# EasyEDA Pro project ProPrj_BSPD_2025-08-26.epro, schematic Schematic2
Board Name: LING; Create Date: 2025-08-26; Page Name: P1; Project Name: BSPD; Schematic Name: Schematic2; Update Date: 2025-08-26; Company: 嘉立创EDA; Page Size: A4; Version: V1.0
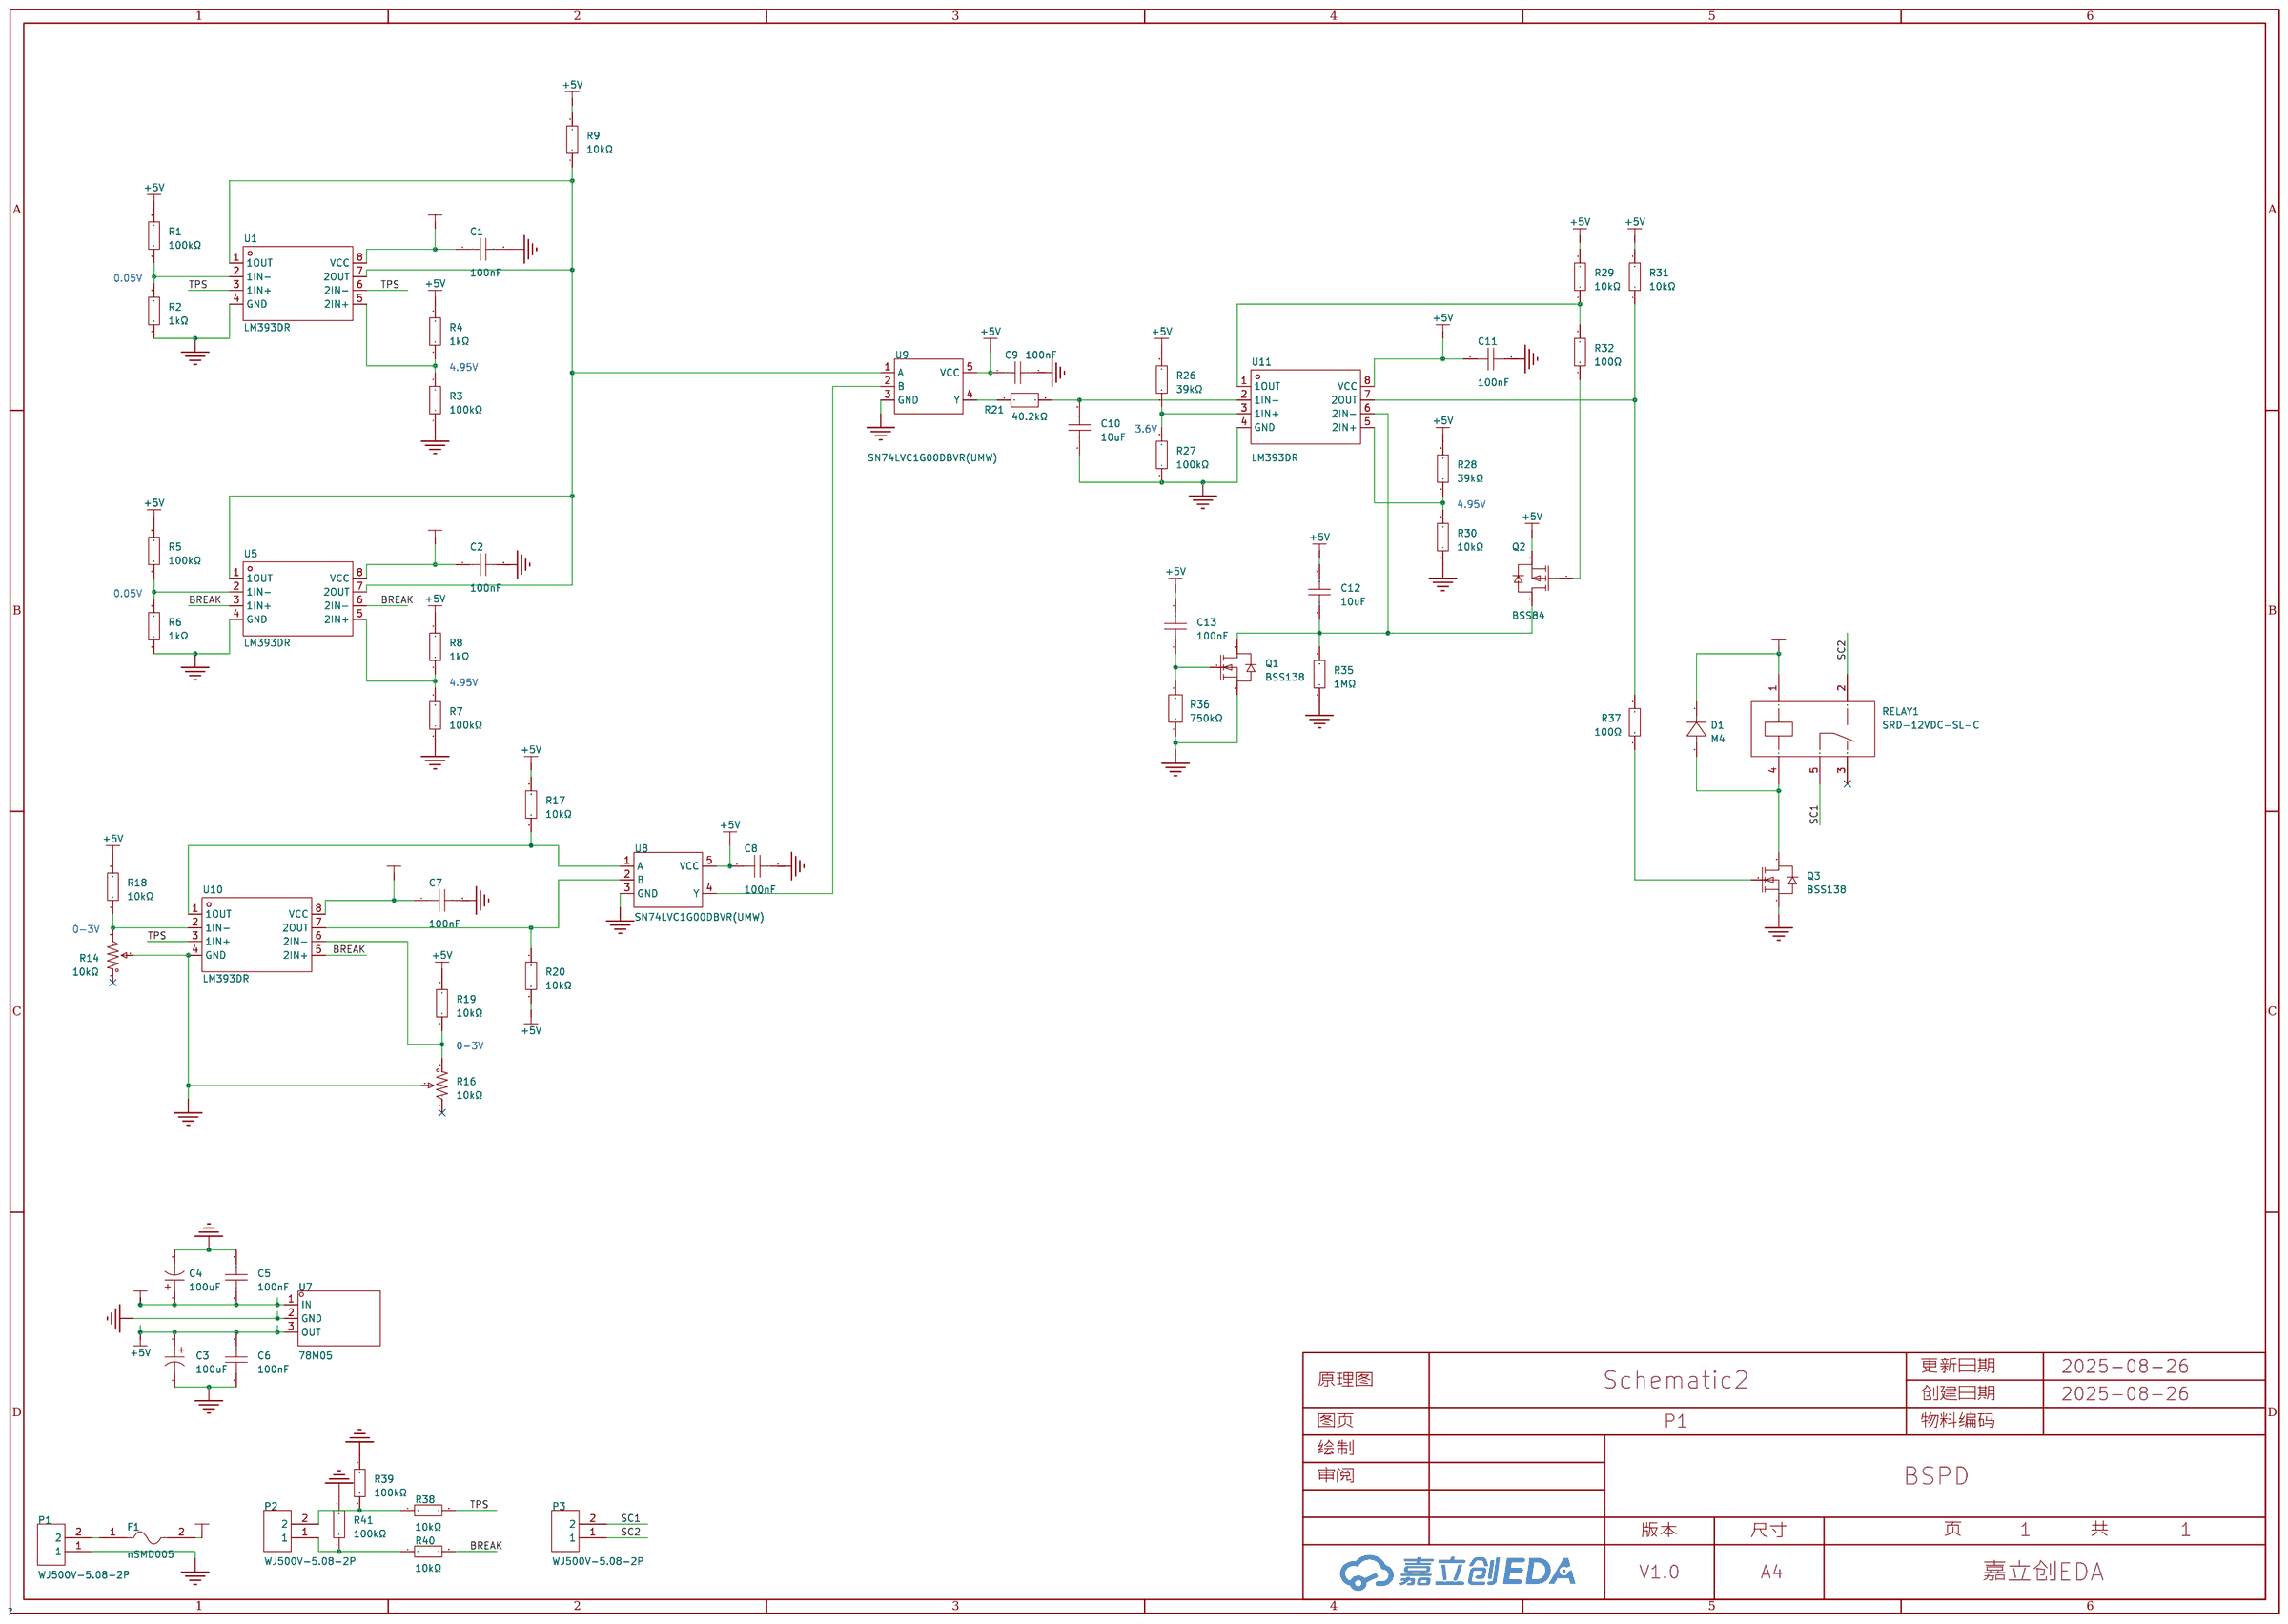
[diagram p1: schematic sheet]

## Parts
C1  100nF  [C0603]
C2  100nF  [C0603]
C3  100uF  [CAP-SMD_BD6.3-L6.6-W6.6-LS7.4-FD]
C4  100uF  [CAP-SMD_BD6.3-L6.6-W6.6-LS7.4-FD]
C5  100nF  [C0603]
C6  100nF  [C0603]
C7  100nF  [C0603]
C8  100nF  [C0603]
C9  100nF  [C0603]
C10  10uF  [C0603]
C11  100nF  [C0603]
C12  10uF  [C0603]
C13  100nF  [C0603]
D1  M4  [SMA_L4.3-W2.6-LS5.0-RD]
F1  nSMD005  [F1206]
P1  WJ500V-5.08-2P  [CONN-TH_2P-P5.00_WJ500V-5.08-2P]
P2  WJ500V-5.08-2P  [CONN-TH_2P-P5.00_WJ500V-5.08-2P]
P3  WJ500V-5.08-2P  [CONN-TH_2P-P5.00_WJ500V-5.08-2P]
Q1  BSS138  [SOT-23-3_L2.9-W1.3-P1.90-LS2.4-BR]
Q2  BSS84  [SOT-23-3_L2.9-W1.3-P1.90-LS2.4-BR-1]
Q3  BSS138  [SOT-23-3_L2.9-W1.3-P1.90-LS2.4-BR]
R1  100kΩ  [R0603]
R2  1kΩ  [R0603]
R3  100kΩ  [R0603]
R4  1kΩ  [R0603]
R5  100kΩ  [R0603]
R6  1kΩ  [R0603]
R7  100kΩ  [R0603]
R8  1kΩ  [R0603]
R9  10kΩ  [R0603]
R14  10kΩ  [RES-ADJ-TH_3P-L10.0-W10.0-P2.50-L]
R16  10kΩ  [RES-ADJ-TH_3P-L10.0-W10.0-P2.50-L]
R17  10kΩ  [R0603]
R18  10kΩ  [R0603]
R19  10kΩ  [R0603]
R20  10kΩ  [R0603]
R21  40.2kΩ  [R0603]
R26  39kΩ  [R0603]
R27  100kΩ  [R0603]
R28  39kΩ  [R0603]
R29  10kΩ  [R0603]
R30  10kΩ  [R0603]
R31  10kΩ  [R0603]
R32  100Ω  [R0603]
R35  1MΩ  [R0603]
R36  750kΩ  [R0603]
R37  100Ω  [R0603]
R38  10kΩ  [R0603]
R39  100kΩ  [R0603]
R40  10kΩ  [R0603]
R41  100kΩ  [R0603]
RELAY1  SRD-12VDC-SL-C  [RELAY-TH_SRD-XXVDC-XL-C]
U1  LM393DR  [SOIC-8_L5.0-W4.0-P1.27-LS6.0-BL]
U5  LM393DR  [SOIC-8_L5.0-W4.0-P1.27-LS6.0-BL]
U7  78M05  [TO-252-2_L6.6-W6.1-P4.57-LS9.9-BR-CW]
U8  SN74LVC1G00DBVR(UMW)  [SOT-23-5_L2.9-W1.6-P0.95-LS2.8-BL]
U9  SN74LVC1G00DBVR(UMW)  [SOT-23-5_L2.9-W1.6-P0.95-LS2.8-BL]
U10  LM393DR  [SOIC-8_L5.0-W4.0-P1.27-LS6.0-BL]
U11  LM393DR  [SOIC-8_L5.0-W4.0-P1.27-LS6.0-BL]

## Library data of the parts
C1 C2 C5-C9 C11 C13 = CGA0603X7R104K500JT: 容值:100nF;精度:±10%;额定电压:50V;温度系数:X7R;; LCSC Part Name: 100nF ±10% 50V; Supplier Part: C6119867; Manufacturer: HRE(芯声); Supplier Footprint: 0603; JLCPCB Part Class: 扩展库; Datasheet: https://atta.szlcsc.com/upload/public/pdf/source/20250103/C44077DA9E7B3EFAE02F22B6D3D1CBC9.pdf; Supplier: LCSC; Tolerance: ±10%; Voltage Rating: 50V; Temperature Coefficient: X7R
C3 C4 = RVT100UF35V67RV0034: 容值:100uF;精度:±20%;额定电压:35V;纹波电流:87mA@120kHz;等效串联电阻:-;; LCSC Part Name: 100uF ±20% 35V; Supplier Part: C2836442; Manufacturer: KNSCHA(科尼盛); Supplier Footprint: SMD,D6.3xL7.7mm; JLCPCB Part Class: 扩展库; Datasheet: https://atta.szlcsc.com/upload/public/pdf/source/20210528/C2836442_7F6389BF36F63F32D6DF3A507E8E95D6.pdf; Supplier: LCSC; Tolerance: ±20%; Rated Voltage: 35V; Ripple Current: 87mA@120kHz; φD: 6.3mm; L: 7.7mm; Lifetime @ Temp: 2000hrs@105℃; Operating Temperature: -55℃~+105℃
C10 C12 = CGA0603X5R106K100JT: 容值:10uF;精度:±10%;额定电压:10V;温度系数:X5R;; LCSC Part Name: 10uF ±10% 10V; Supplier Part: C6119842; Manufacturer: HRE(芯声); Supplier Footprint: 0603; JLCPCB Part Class: 扩展库; Supplier: LCSC; Tolerance: ±10%; Voltage Rating: 10V; Temperature Coefficient: X5R
D1 = M4_C18199095: 二极管配置:独立式;正向压降(Vf):1V@1A;直流反向耐压(Vr):400V;整流电流:1A;; Supplier Part: C18199095; Manufacturer: 宏迦橙; Supplier Footprint: SMA(DO-214AC); JLCPCB Part Class: 扩展库; Datasheet: https://atta.szlcsc.com/upload/public/pdf/source/20231013/89B063F116204BE8B8ABA73B73AC0E7A.pdf; Supplier: LCSC; Diode Configuration: 独立式; Forward Voltage (Vf@If): 1V@1A; Reverse Voltage (Vr): 400V; Rectified Current: 1A; Reverse Leakage Current (Ir): 2uA@400V
F1 = nSMD005: 耐压:60V;最大电流:100A;保持电流(Ih):50mA;跳闸电流:150mA;; LCSC Part Name: 60V 50mA 1206自恢复; Supplier Part: C70064; Manufacturer: 台湾陆海; Supplier Footprint: 1206; JLCPCB Part Class: 扩展库; Datasheet: https://atta.szlcsc.com/upload/public/pdf/source/20160331/1459396376533.pdf; Supplier: LCSC; Voltage - Max: 60V; Current - Max: 100A; Hold Current: 50mA; Trip Current: 150mA
P1-P3 = WJ500V-5.08-2P: 结构:1x2P;间距:5.08mm;颜色:绿色;安装方式:直插;额定电流:18A;额定电压:250V;排数:1;线规 - AWG:14~30;线规 - 平方毫米:2.5;每排PIN数:2;触头材质:-;触头镀层:-;工作温度范围:-40℃~+105℃;焊接温度(最大值):-;; LCSC Part Name: 1x2P 5.08mm 直插 排数:1 每排P数:2; Supplier Part: C8465; Manufacturer: KANGNEX(康奈克斯电气); Supplier Footprint: 插件,P=5.08mm; JLCPCB Part Class: 扩展库; Datasheet: https://atta.szlcsc.com/upload/public/pdf/source/20191225/C8465_02D34CE5B5B4A53DF5891601D97FA9F4.pdf; Supplier: LCSC; Structure: 1x2P; Pitch: 5.08mm; Color: 绿色; Mounting Style: 直插; Current Rating (Max): 18A; Voltage Rating (Max): 250V; Number of Pins: 2P; Number of Rows: 1; Wire Gauge - AWG: 14~30; Wire Gauge - mm2: 2.5; Number of PINs Per Row: 2; Operating Temperature Range: -40℃~+105℃; Screw Specification: M2.5
Q1 Q3 = BSS138_C7420339: 类型:1个N沟道;漏源电压(Vdss):50V;连续漏极电流(Id):340mA;导通电阻(RDS(on)):2.5Ω@10V,340mA;耗散功率(Pd):350mW;阈值电压(Vgs(th)):1.6V;; LCSC Part Name: N沟道,电流:340mA,耐压:50V; Supplier Part: C7420339; Manufacturer: 宏嘉诚; Supplier Footprint: SOT-23; JLCPCB Part Class: 扩展库; Datasheet: https://atta.szlcsc.com/upload/public/pdf/source/20250106/6679E24F3D42D0BF4A4F6E14986335A4.pdf; Supplier: LCSC; Type: 1个N沟道; Drain to Source Voltage: 50V; Current - Continuous Drain(Id): 340mA; RDS(on): 2.5Ω@10V,340mA; Pd - Power Dissipation: 350mW; Gate Threshold Voltage (Vgs(th)@Id): 1.6V; Gate Charge(Qg): 1.7nC@10V; Input Capacitance(Ciss@Vds): 17.5pF@25V; Reverse Transfer Capacitance (Crss@Vds): 6.5pF@25V; Operating Temperature: -55℃~+150℃
Q2 = BSS84_C7420340: 类型:1个P沟道;漏源电压(Vdss):60V;连续漏极电流(Id):170mA;导通电阻(RDS(on)):8Ω@10V,0.17A;耗散功率(Pd):225mW;阈值电压(Vgs(th)):900mV;; LCSC Part Name: P沟道,电流:-0.17A,耐压:-60V; Supplier Part: C7420340; Manufacturer: 宏嘉诚; Supplier Footprint: SOT-23; JLCPCB Part Class: 扩展库; Datasheet: https://atta.szlcsc.com/upload/public/pdf/source/20250106/7DBB75318F8E5F43EACD3BE75B7C3ED0.pdf; Supplier: LCSC; Type: 1个P沟道; Drain to Source Voltage: 60V; Current - Continuous Drain(Id): 170mA; RDS(on): 8Ω@10V,0.17A; Pd - Power Dissipation: 225mW; Gate Threshold Voltage (Vgs(th)@Id): 900mV; Gate Charge(Qg): 1.77nC@10V; Input Capacitance(Ciss@Vds): 43pF; Reverse Transfer Capacitance (Crss@Vds): 2.8pF; Operating Temperature: -55℃~+150℃
R1 R3 R5 R7 R27 R39 R41 = 0603WAF1003T5E: 电阻类型:厚膜电阻;阻值:100kΩ;精度:±1%;功率:100mW;最大工作电压:75V;温度系数:±100ppm/℃;; LCSC Part Name: 100kΩ ±1% 100mW 厚膜电阻; Supplier Part: C25803; Manufacturer: UNI-ROYAL(厚声); Supplier Footprint: 0603; JLCPCB Part Class: 基础库; Datasheet: https://atta.szlcsc.com/upload/public/pdf/source/20200306/C422600_1E6D84923E4A46A82E41ADD87F860B5C.pdf; Supplier: LCSC; Type: 厚膜电阻; Tolerance: ±1%; Power(Watts): 100mW; Overload Voltage (Max): 75V; Temperature Coefficient: ±100ppm/℃; Operating Temperature Range: -55℃~+155℃
R2 R4 R6 R8 = 0603WAF1001T5E: 电阻类型:厚膜电阻;阻值:1kΩ;精度:±1%;功率:100mW;最大工作电压:75V;温度系数:±100ppm/℃;; LCSC Part Name: 1kΩ ±1% 100mW 厚膜电阻; Supplier Part: C21190; Manufacturer: UNI-ROYAL(厚声); Supplier Footprint: 0603; JLCPCB Part Class: 基础库; Datasheet: https://atta.szlcsc.com/upload/public/pdf/source/20200306/C422600_1E6D84923E4A46A82E41ADD87F860B5C.pdf; Supplier: LCSC; Type: 厚膜电阻; Tolerance: ±1%; Power(Watts): 100mW; Overload Voltage (Max): 75V; Temperature Coefficient: ±100ppm/℃; Operating Temperature Range: -55℃~+155℃
R9 R17-R20 R29-R31 R38 R40 = 0603WAF1002T5E: 电阻类型:厚膜电阻;阻值:10kΩ;精度:±1%;功率:100mW;最大工作电压:75V;温度系数:±100ppm/℃;; LCSC Part Name: 厚膜电阻 10kΩ ±1% 100mW; Supplier Part: C25804; Manufacturer: UNI-ROYAL(厚声); Supplier Footprint: 0603; JLCPCB Part Class: 基础库; Datasheet: https://atta.szlcsc.com/upload/public/pdf/source/20200306/C422600_1E6D84923E4A46A82E41ADD87F860B5C.pdf; Supplier: LCSC; Type: 厚膜电阻; Tolerance: ±1%; Power(Watts): 100mW; Overload Voltage (Max): 75V; Temperature Coefficient: ±100ppm/℃; Operating Temperature Range: -55℃~+155℃
R14 R16 = 3296W-1-103: 阻值:10kΩ;精度:±10%;; LCSC Part Name: 10kΩ ±10%; Supplier Part: C118954; Manufacturer: BOCHEN(博晨); Supplier Footprint: 插件; JLCPCB Part Class: 扩展库; Datasheet: https://atta.szlcsc.com/upload/public/pdf/source/20171114/C118954_15106326646611117443.pdf; Supplier: LCSC; Tolerance: ±10%
R21 = FRC0603F4022TS: 电阻类型:厚膜电阻;阻值:40.2kΩ;精度:±1%;功率:100mW;最大工作电压:75V;温度系数:±100ppm/℃;; LCSC Part Name: 40.2kΩ ±1% 100mW 厚膜电阻; Supplier Part: C2933218; Manufacturer: FOJAN(富捷); Supplier Footprint: 0603; JLCPCB Part Class: 扩展库; Datasheet: https://atta.szlcsc.com/upload/public/pdf/source/20211221/925EC7D7225764EE0046F22065062C87.pdf; Supplier: LCSC; Type: 厚膜电阻; Tolerance: ±1%; Power(Watts): 100mW; Overload Voltage (Max): 75V; Temperature Coefficient: ±100ppm/℃; Operating Temperature Range: -55℃~+155℃
R26 R28 = 0603WAF3902T5E: 电阻类型:厚膜电阻;阻值:39kΩ;精度:±1%;功率:100mW;最大工作电压:75V;温度系数:±100ppm/℃;; LCSC Part Name: 39kΩ ±1% 100mW 厚膜电阻; Supplier Part: C23153; Manufacturer: UNI-ROYAL(厚声); Supplier Footprint: 0603; JLCPCB Part Class: 基础库; Datasheet: https://atta.szlcsc.com/upload/public/pdf/source/20200306/C422600_1E6D84923E4A46A82E41ADD87F860B5C.pdf; Supplier: LCSC; Type: 厚膜电阻; Tolerance: ±1%; Power(Watts): 100mW; Overload Voltage (Max): 75V; Temperature Coefficient: ±100ppm/℃; Operating Temperature Range: -55℃~+155℃
R32 R37 = 0603WAF1000T5E: 电阻类型:厚膜电阻;阻值:100Ω;精度:±1%;功率:100mW;最大工作电压:75V;温度系数:±200ppm/℃;; LCSC Part Name: 100Ω ±1% 100mW 厚膜电阻; Supplier Part: C22775; Manufacturer: UNI-ROYAL(厚声); Supplier Footprint: 0603; JLCPCB Part Class: 基础库; Datasheet: https://atta.szlcsc.com/upload/public/pdf/source/20200306/C422600_1E6D84923E4A46A82E41ADD87F860B5C.pdf; Supplier: LCSC; Type: 厚膜电阻; Tolerance: ±1%; Power(Watts): 100mW; Overload Voltage (Max): 75V; Temperature Coefficient: ±200ppm/℃; Operating Temperature Range: -55℃~+155℃
R35 = 0603WAF1004T5E: 电阻类型:厚膜电阻;阻值:1MΩ;精度:±1%;功率:100mW;最大工作电压:75V;温度系数:±100ppm/℃;; LCSC Part Name: 1MΩ ±1% 100mW 厚膜电阻; Supplier Part: C22935; Manufacturer: UNI-ROYAL(厚声); Supplier Footprint: 0603; JLCPCB Part Class: 基础库; Datasheet: https://atta.szlcsc.com/upload/public/pdf/source/20200306/C422600_1E6D84923E4A46A82E41ADD87F860B5C.pdf; Supplier: LCSC; Type: 厚膜电阻; Tolerance: ±1%; Power(Watts): 100mW; Overload Voltage (Max): 75V; Temperature Coefficient: ±100ppm/℃; Operating Temperature Range: -55℃~+155℃
R36 = FRC0603J754 TS: 电阻类型:厚膜电阻;阻值:750kΩ;精度:±5%;功率:100mW;最大工作电压:75V;温度系数:±100ppm/℃;; LCSC Part Name: 750kΩ ±5% 100mW 厚膜电阻; Supplier Part: C2907201; Manufacturer: FOJAN(富捷); Supplier Footprint: 0603; JLCPCB Part Class: 扩展库; Datasheet: https://atta.szlcsc.com/upload/public/pdf/source/20211221/925EC7D7225764EE0046F22065062C87.pdf; Supplier: LCSC; Type: 厚膜电阻; Tolerance: ±5%; Power(Watts): 100mW; Overload Voltage (Max): 75V; Temperature Coefficient: ±100ppm/℃; Operating Temperature Range: -55℃~+155℃
RELAY1 = SRD-12VDC-SL-C: 线圈电压:12V;触点形式:一组转换:1C(单刀双掷-转换);触点容量(电阻负载):-;最大切换电压:250V@AC;最大切换电流:15A;; Supplier Part: C30431; Manufacturer: 松乐; Supplier Footprint: 插件,15.6x19.2mm; JLCPCB Part Class: 扩展库; Datasheet: https://atta.szlcsc.com/upload/public/pdf/source/20200305/C490149_C96E4098A3B1FFB377D5AD2E40B7C2A8.pdf; Supplier: LCSC; Coil Voltage: 12V; Contact Form: 一组转换:1C(单刀双掷-转换); Pin Number: 5; Maximum Switching Voltage: 250V@AC; Coil Rated Power: 360mW; Maximum Switching Current: 15A; Coil Type: 无极性-单线圈; Coil Resistance: 400Ω; Contact Resistance: 100mΩ; Operate Time: 10ms; Release Time: 10ms
U1 U5 U10 U11 = LM393DR: 输入失调电压(Vos):5mV;输入偏置电流(Ib):250nA;; Supplier Part: C67470; Manufacturer: TI(德州仪器); Supplier Footprint: SOIC-8; JLCPCB Part Class: 扩展库; Datasheet: https://www.ti.com/cn/lit/gpn/lm393; Supplier: LCSC; Input Offset Voltage (Vos): 5mV; Input Bias Current (Ib): 250nA; Supply Voltage: 1V~18V；2V~36V; Output Type: 开集; Supply Current: 2.5mA; Operating Temperature: 0℃~+70℃
U7 = 78M05_C347278: 输出类型:固定;最大输入电压:35V;输出电压:5V;输出电流:1A;电源纹波抑制比(PSRR):80dB@(120Hz);输出极性:正极;; LCSC Part Name: 输入35V 输出5V; Supplier Part: C347278; Manufacturer: UMW(友台半导体); Supplier Footprint: TO-252-2; JLCPCB Part Class: 扩展库; Datasheet: https://atta.szlcsc.com/upload/public/pdf/source/20240827/0E07D62EB5B1694607256ADF81712489.pdf; Supplier: LCSC; Output Type: 固定; Maximum Input Voltage: 35V; Output Voltage: 5V; Output Current: 1A; Power Supply Rejection Ratio (PSRR): 80dB@(120Hz); Dropout Voltage: 2V@(500mA); standby current: 6mA; Feature: 短路保护；热保护(TSD); Operating Temperature: -20℃~+85℃; Output Polarity: 正极; Number of Outputs: 1
U8 U9 = SN74LVC1G00DBVR(UMW): 逻辑类型:与非门;通道数:1;工作电压:1.65V~5.5V;静态电流(Iq):10uA;传播延迟(tpd):10ns@5V,15pF;; LCSC Part Name: 门极和反相器; Supplier Part: C434066; Manufacturer: UMW(友台半导体); Supplier Footprint: SOT-23-5; JLCPCB Part Class: 扩展库; Datasheet: https://atta.szlcsc.com/upload/public/pdf/source/20240514/189D9F5C308E2EFD5DBBE0C24B0B7D67.pdf; Supplier: LCSC; Logic Gate Type: 与非门; Number of Channels: 1; Supply Voltage: 1.65V~5.5V; Quiescent Current (Max): 10uA; Sink Current: 32mA; Source Current: 32mA; High Level Range (VIH): 1.7V; Series: 74LVC系列; Propagation Delay Time: 10ns@5V,15pF; Operating Temperature: -40℃~+105℃

## Nets
12V: C1.1 C2.1 C4.1 C5.2 C7.1 D1.1(K) F1.2 RELAY1.1 U1.8(VCC) U5.8(VCC) U7.1(IN) U10.8(VCC)
+5V: C3.1 C6.1 C8.1 C9.1 C11.1 C12.2 C13.2 Q2.2(S) R1.2 R4.2 R5.2 R8.2 R9.2 R17.2 R18.2 R19.2 R20.2 R26.2 R28.2 R29.2 R31.2 U7.3(OUT) U8.5(VCC) U9.5(VCC) U11.8(VCC)
GND: C1.2 C2.2 C3.2 C4.2 C5.1 C6.2 C7.2 C8.2 C9.2 C10.1 C11.2 P1.1 Q1.2(S) Q3.2(S) R2.1 R3.1 R6.1 R7.1 R14.2 R16.2 R27.1 R30.1 R35.1 R36.1 R39.1 R41.2 U1.4(GND) U5.4(GND) U7.2(GND) U8.3(GND) U9.3(GND) U10.4(GND) U11.4(GND)
BREAK: R40.2 U5.3(1IN+) U5.6(2IN-) U10.5(2IN+)
SC1: P3.2 RELAY1.5
SC2: P3.1 RELAY1.2
TPS: R38.2 U1.3(1IN+) U1.6(2IN-) U10.3(1IN+)
$1N548: R1.1 R2.2 U1.2(1IN-)
$1N720: R3.2 R4.1 U1.5(2IN+)
$1N1527: R5.1 R6.2 U5.2(1IN-)
$1N1535: R7.2 R8.1 U5.5(2IN+)
$1N3454: R9.1 U1.1(1OUT) U1.7(2OUT) U5.1(1OUT) U5.7(2OUT) U9.1(A)
$1N3800: R14.3 R18.1 U10.2(1IN-)
$1N4317: R17.1 U8.1(A) U10.1(1OUT)
$1N4325: R20.1 U8.2(B) U10.7(2OUT)
$1N4493: R16.1 R19.1 U10.6(2IN-)
$1N4504: U8.4(Y) U9.2(B)
$1N4584: R21.1 U9.4(Y)
$1N5048: R28.1 R30.2 U11.5(2IN+)
$1N5249: R26.1 R27.2 U11.3(1IN+)
$1N5269: C10.2 R21.2 U11.2(1IN-)
$1N5671: R29.1 R32.2 U11.1(1OUT)
$1N6198: C12.1 Q1.3(D) Q2.3(D) R35.2 U11.6(2IN-)
$1N6463: C13.1 Q1.1(G) R36.2
$1N6650: Q3.1(G) R37.2
$1N6763: D1.2(A) Q3.3(D) RELAY1.4
$1N6823: R31.1 R37.1 U11.7(2OUT)
$1N6833: Q2.1(G) R32.1
$1N10439: F1.1 P1.2
$1N10686: P2.1 R40.1 R41.1
$1N10689: P2.2 R38.1 R39.2

Not connected (* = marked no-connect by the designer): R14 1*; R16 3*; RELAY1 3*

## Notes on the sheet
- 0.05V
- 4.95V
- 3.6V
- 4.95V
- 0.05V
- 4.95V
- 0-3V
- 0-3V
